# Altium schematic sheet Sheet2.SchDoc
size 1473 x 381 mm
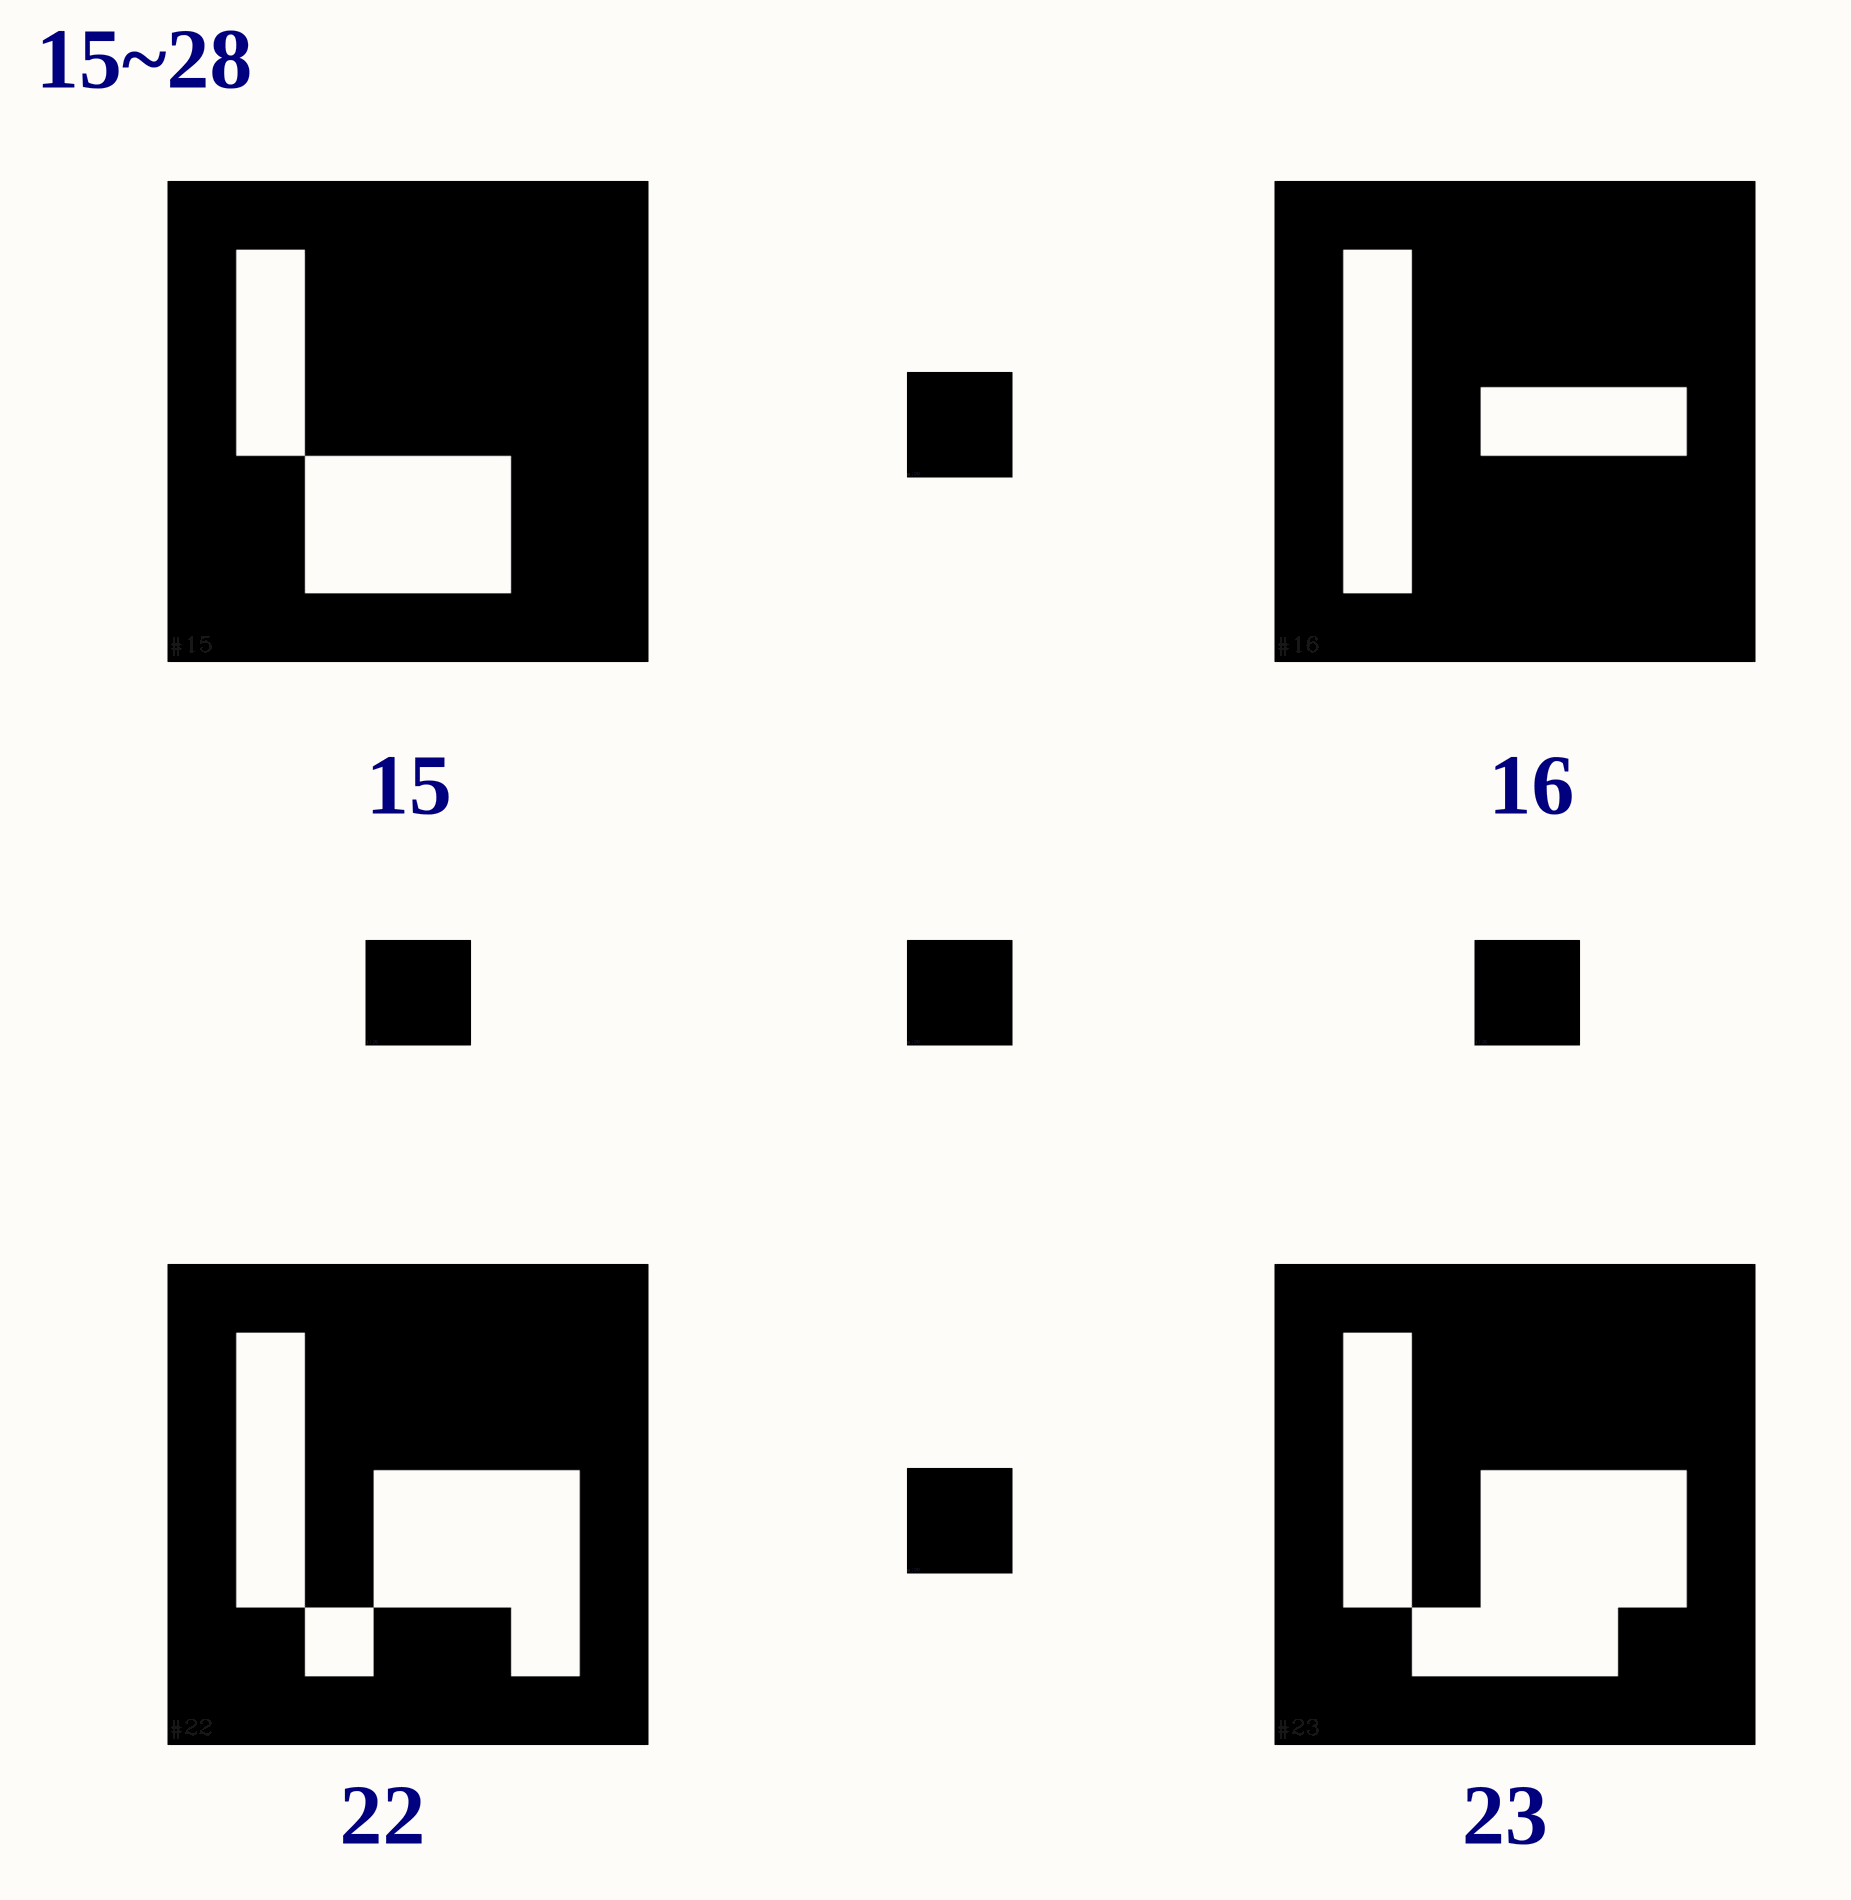
[diagram p0: Sheet2.SchDoc, column 1 of 4]
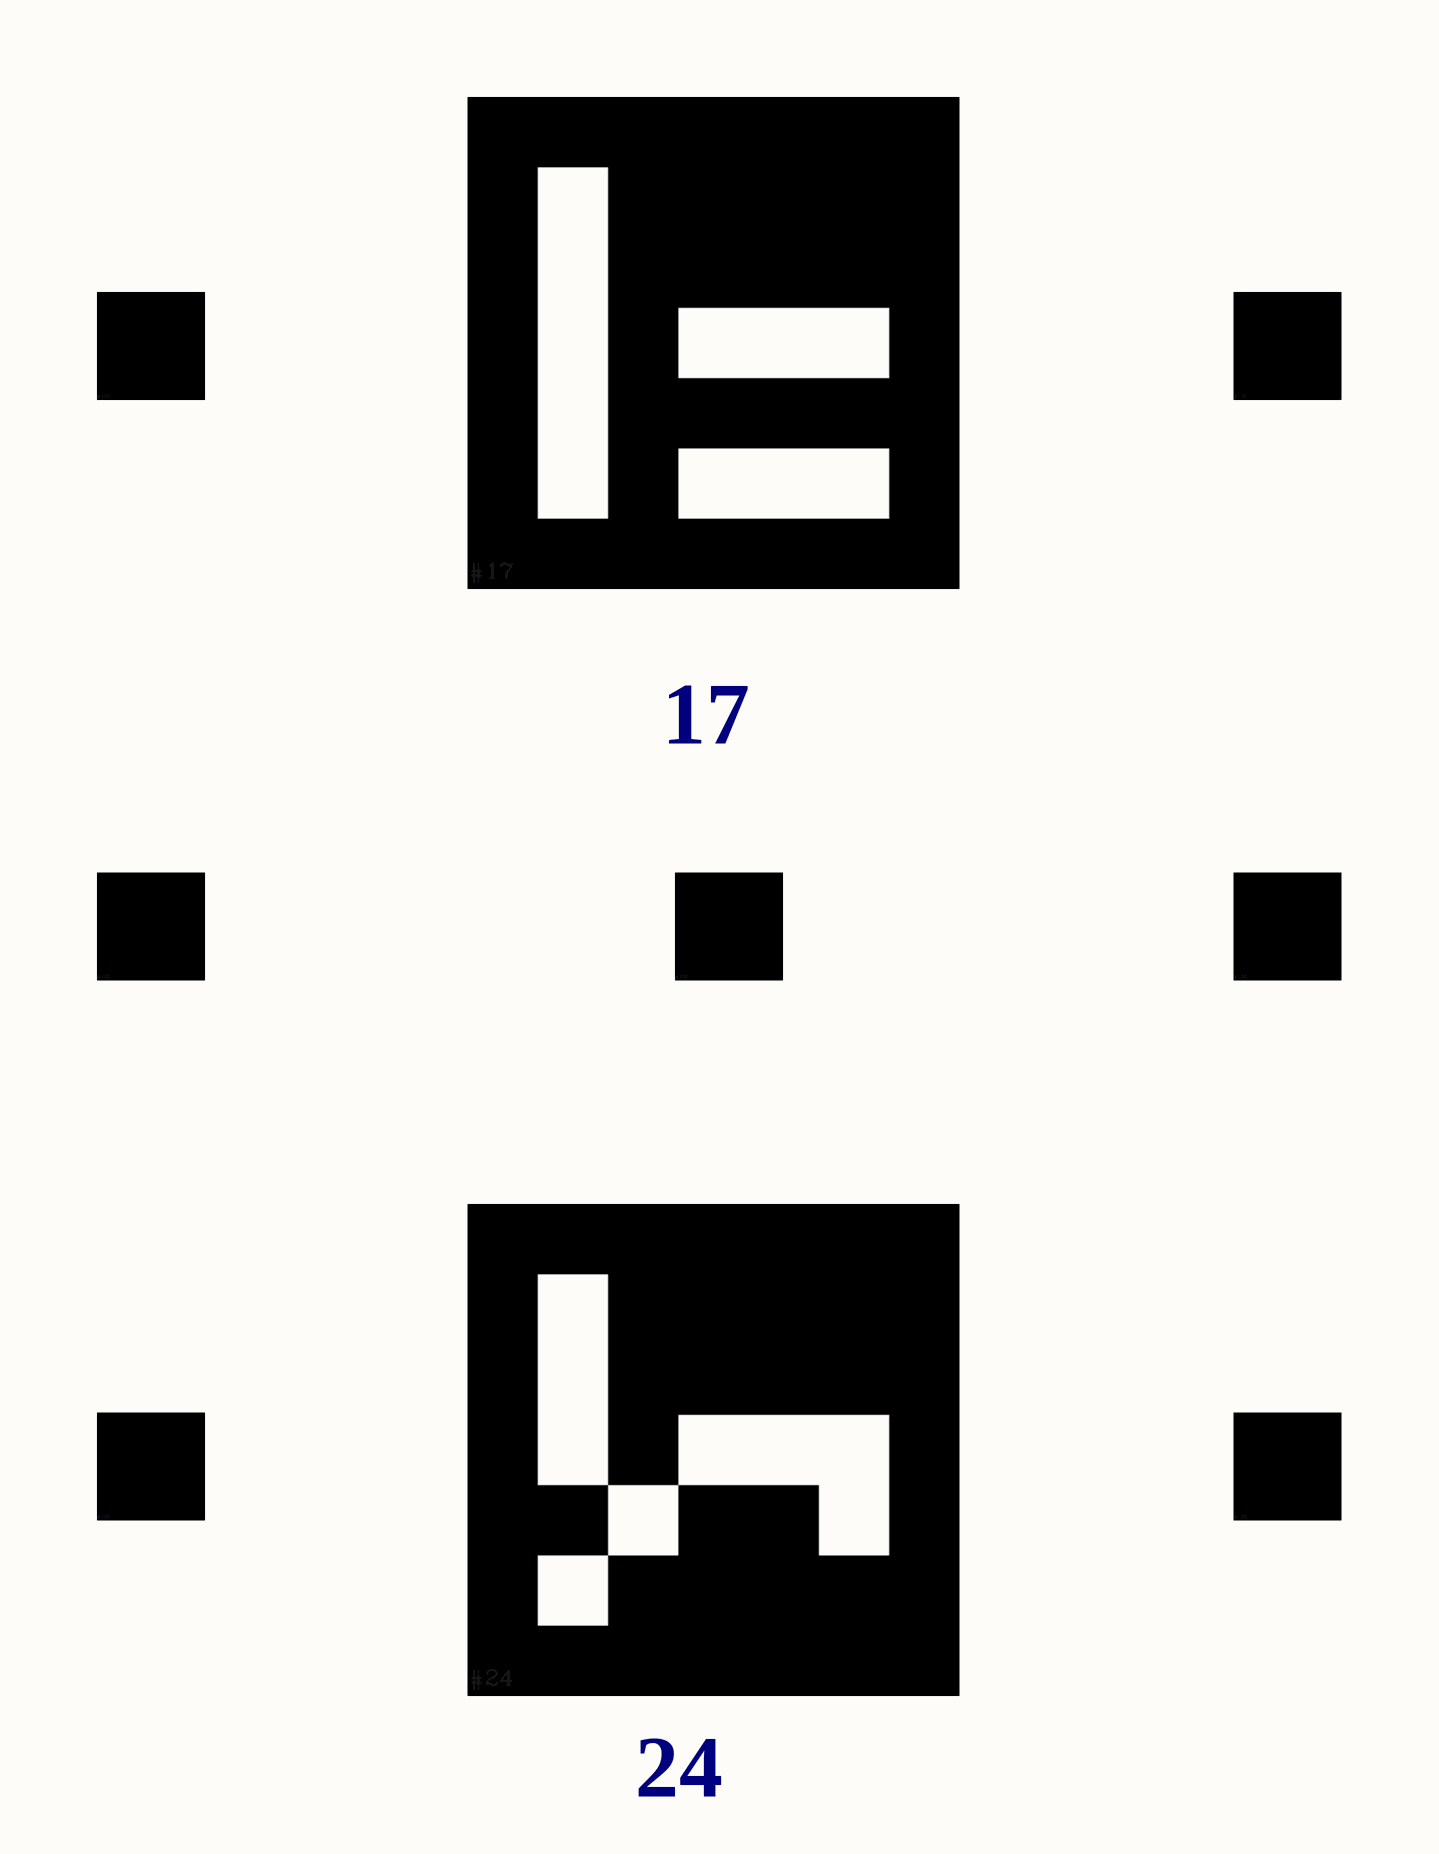
[diagram p1: Sheet2.SchDoc, column 2 of 4]
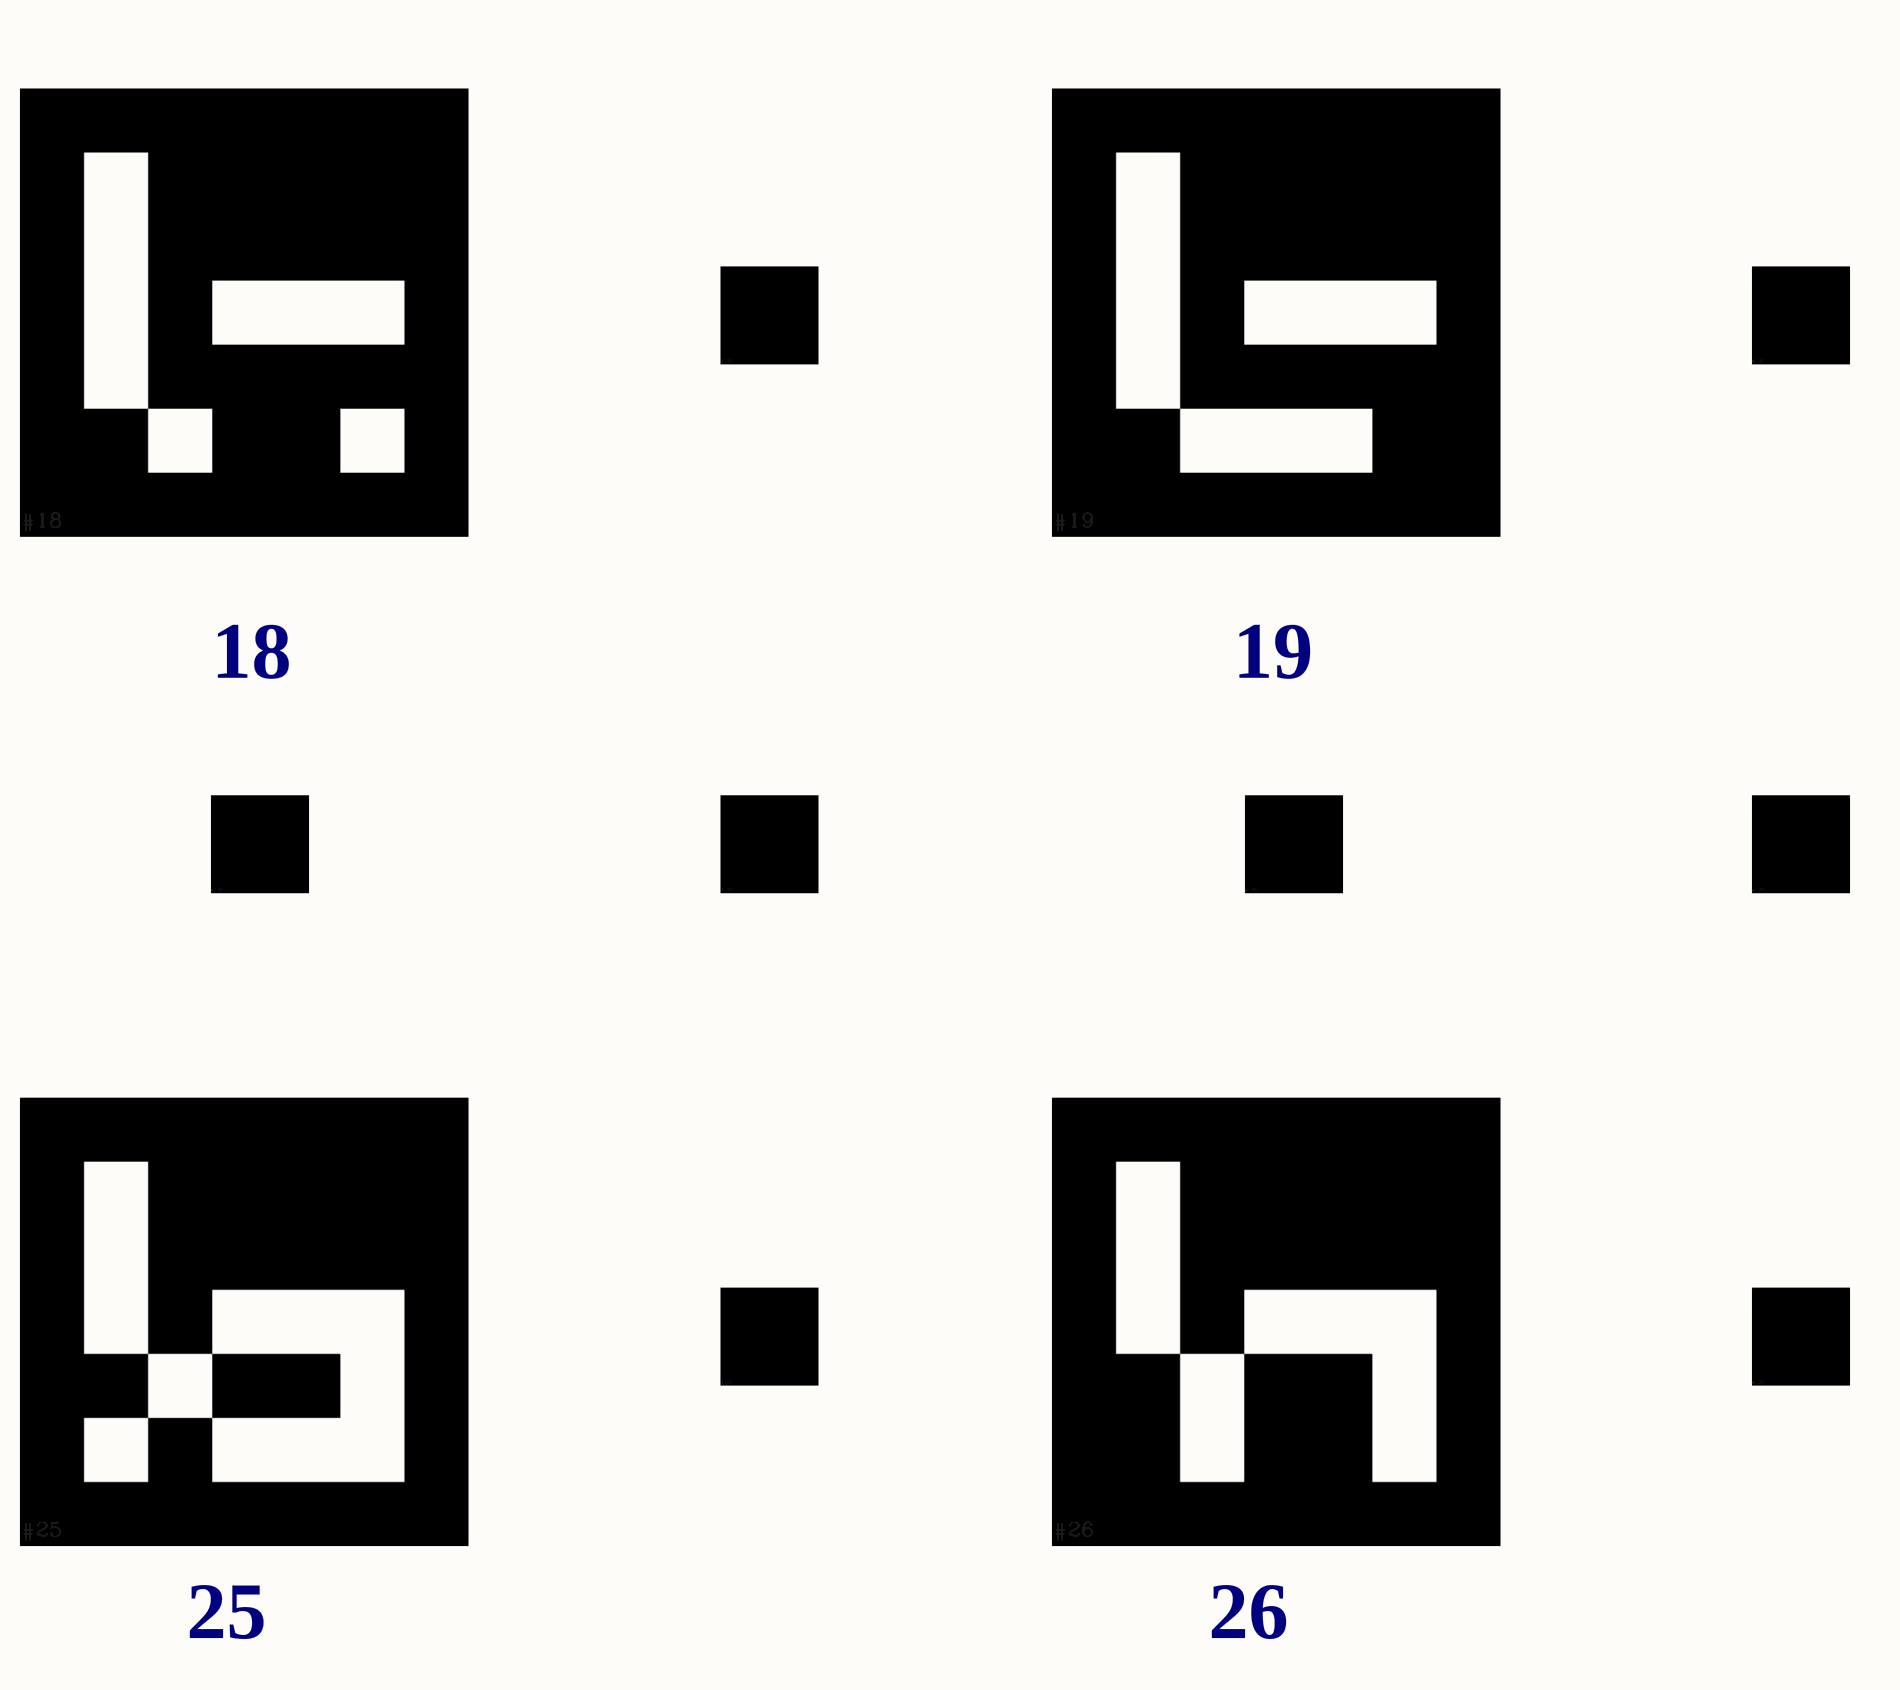
[diagram p2: Sheet2.SchDoc, column 3 of 4]
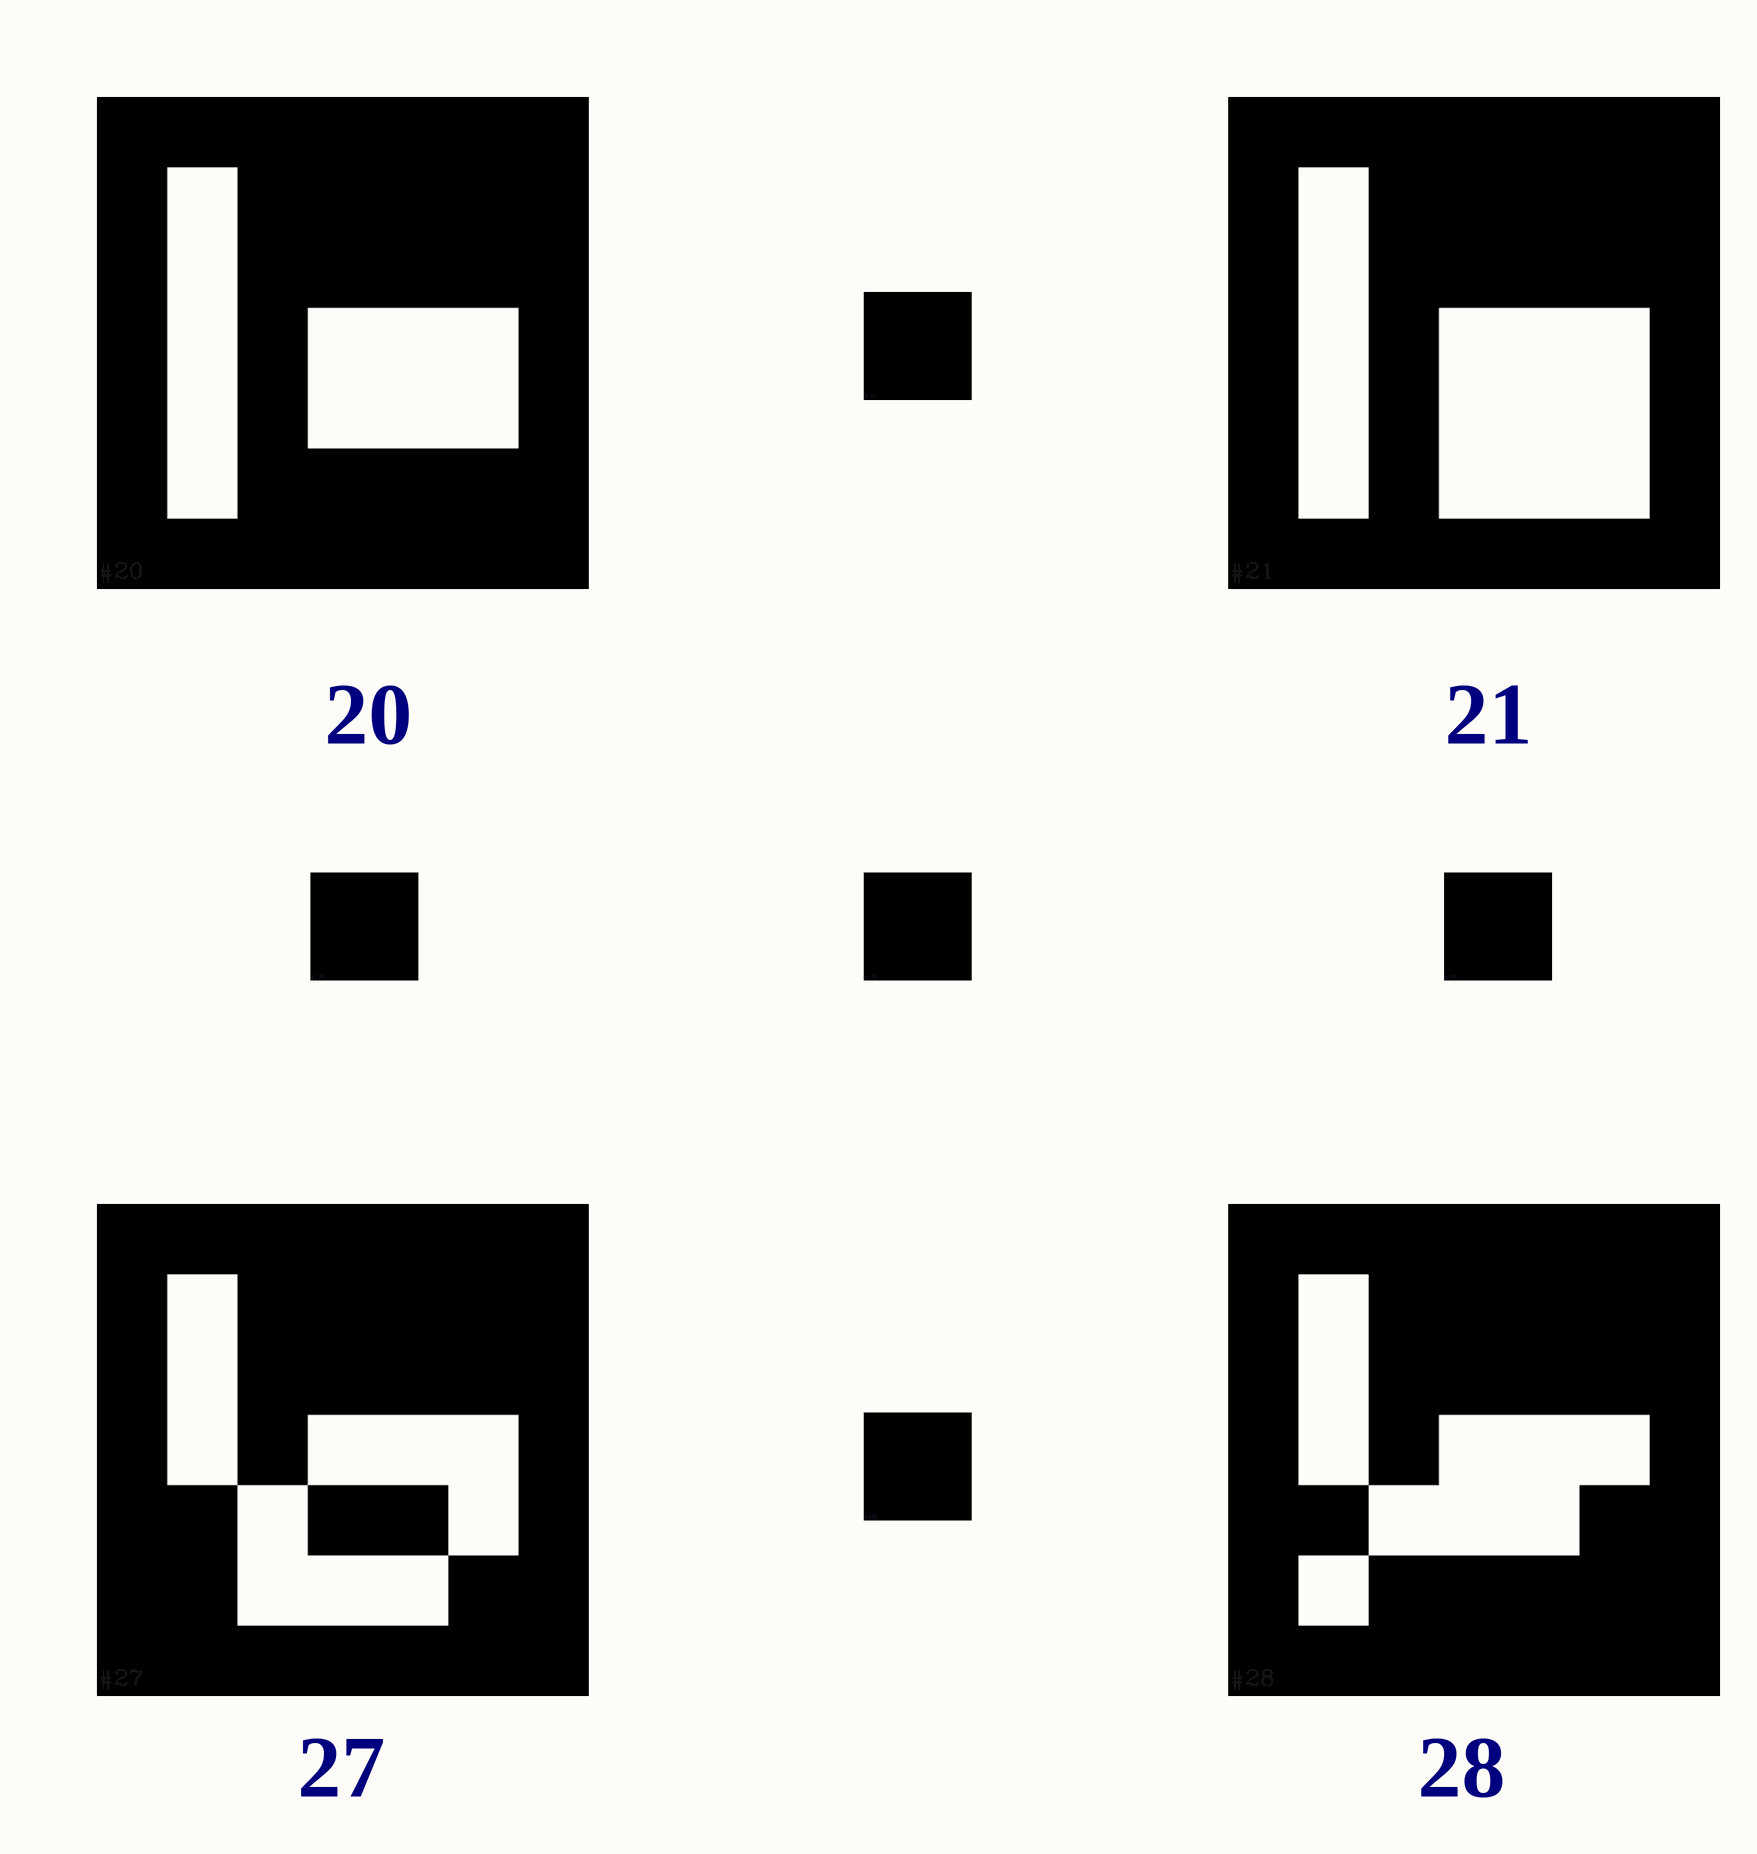
[diagram p3: Sheet2.SchDoc, column 4 of 4]

## Notes on the sheet
- 15~28
- 15
- 16
- 17
- 18
- 19
- 20
- 21
- 22
- 23
- 24
- 25
- 26
- 27
- 28